# EAGLE schematic P2B14-001 (EAGLE 7.1.0)
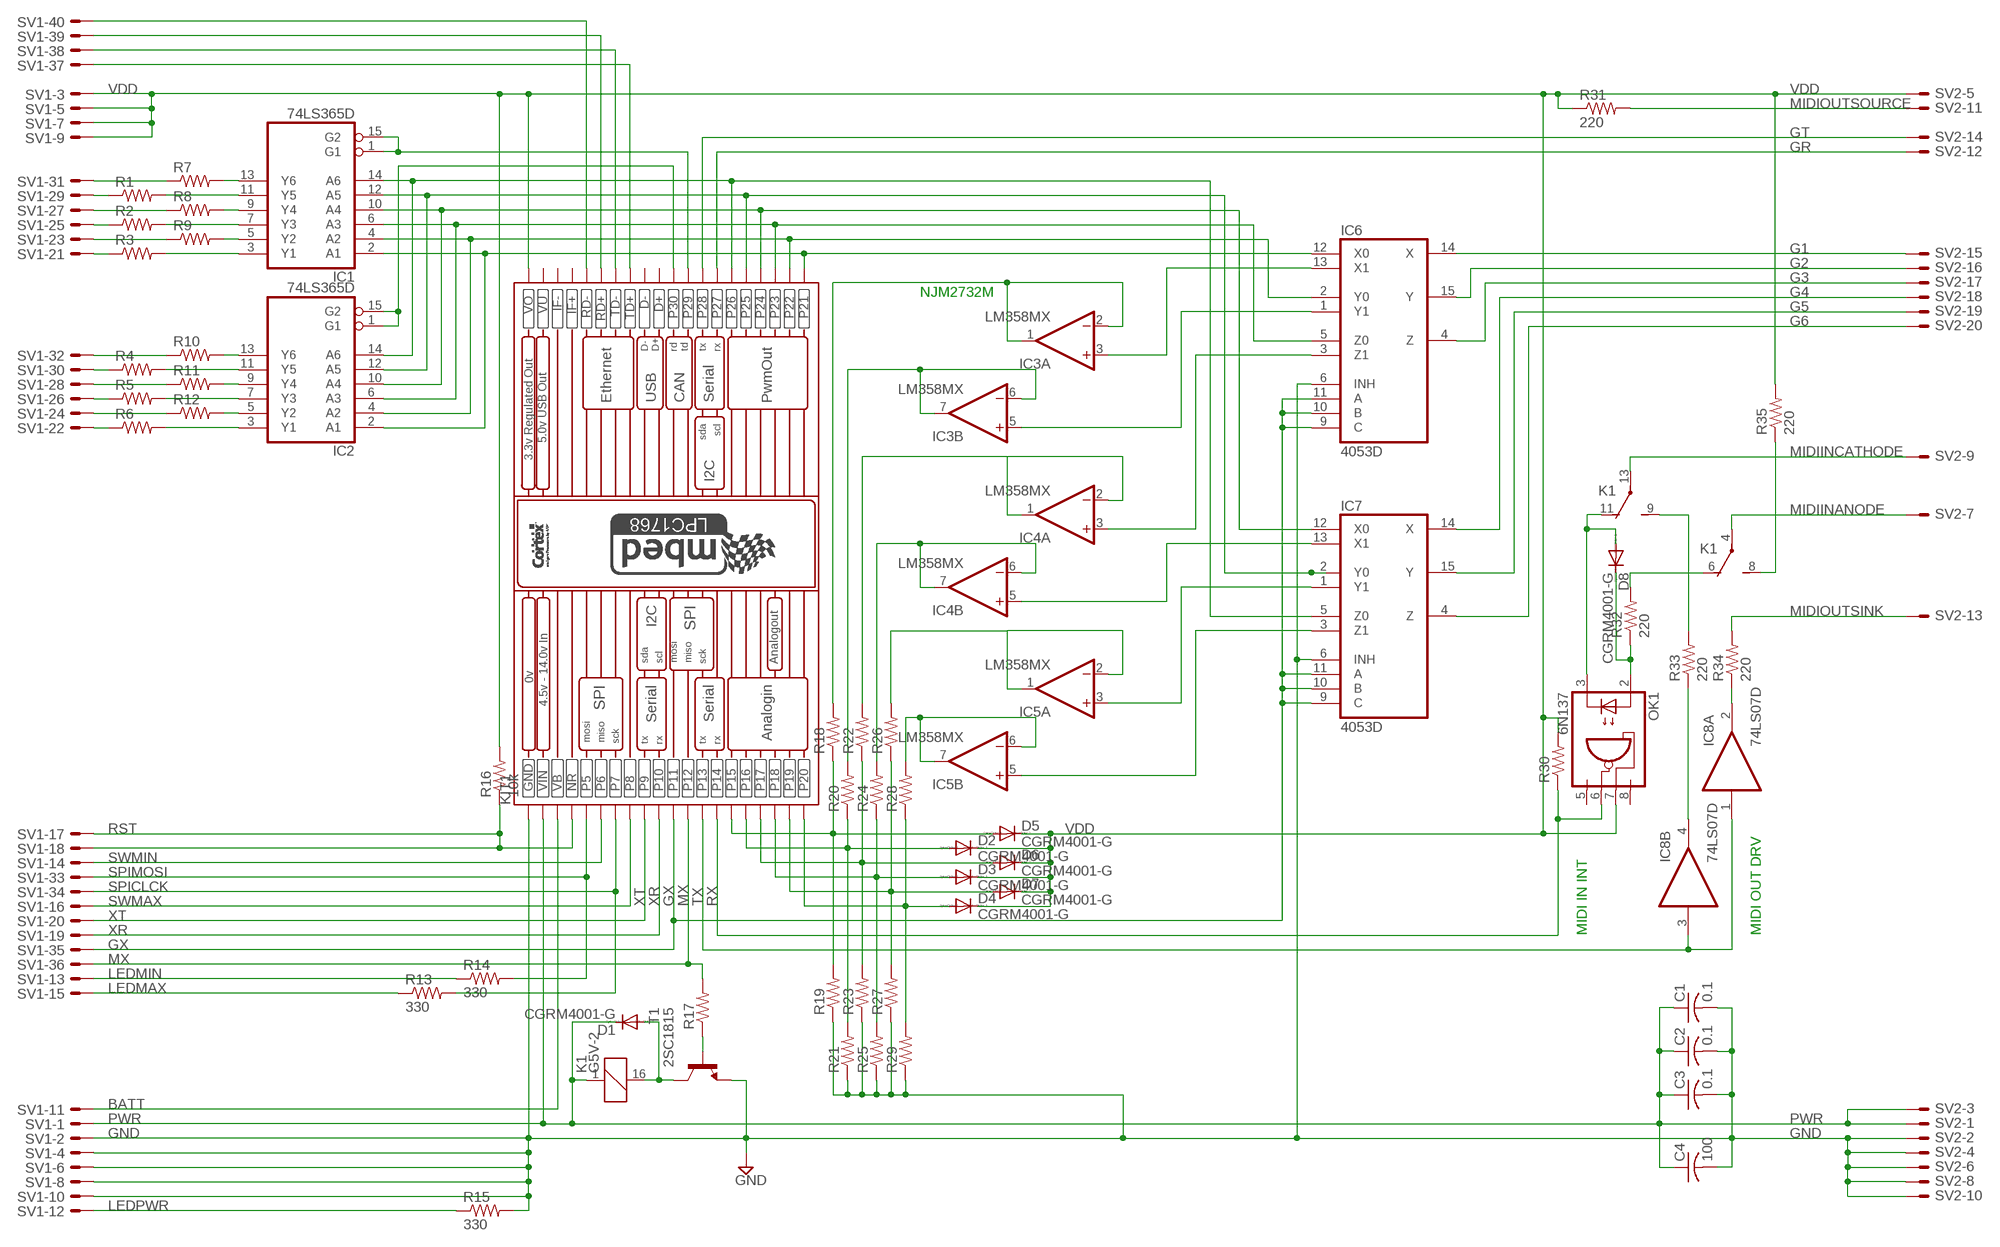
[diagram p0: schematic, sheet 1]

## Parts
C1  0.1  C-USC0402  [C0402]
C2  0.1  C-USC0402  [C0402]
C3  0.1  C-USC0402  [C0402]
C4  100  C-US025-050X050  [C025-050X050]
D1  CGRM4001-G  [SOD-123_MINI-SMA]
D2  CGRM4001-G  [SOD-123_MINI-SMA]
D3  CGRM4001-G  [SOD-123_MINI-SMA]
D4  CGRM4001-G  [SOD-123_MINI-SMA]
D5  CGRM4001-G  [SOD-123_MINI-SMA]
D6  CGRM4001-G  [SOD-123_MINI-SMA]
D7  CGRM4001-G  [SOD-123_MINI-SMA]
D8  CGRM4001-G  [SOD-123_MINI-SMA]
IC1  74LS365D  [SO16]
IC2  74LS365D  [SO16]
IC3  LM358MX  [SO08]
IC4  LM358MX  [SO08]
IC5  LM358MX  [SO08]
IC6  4053D  [SO16]
IC7  4053D  [SO16]
IC8  74LS07D  [SO14]
K1  G5V-2  [G5V-2]
KIT1  MBED_NXP_LPC1768  [MBED-KIT]
OK1  6N137  [DIL08]
R1  R-US_M0805  [M0805]
R2  R-US_M0805  [M0805]
R3  R-US_M0805  [M0805]
R4  R-US_M0805  [M0805]
R5  R-US_M0805  [M0805]
R6  R-US_M0805  [M0805]
R7  R-US_M0805  [M0805]
R8  R-US_M0805  [M0805]
R9  R-US_M0805  [M0805]
R10  R-US_M0805  [M0805]
R11  R-US_M0805  [M0805]
R12  R-US_M0805  [M0805]
R13  330  R-US_M0805  [M0805]
R14  330  R-US_M0805  [M0805]
R15  330  R-US_M0805  [M0805]
R16  10k  R-US_M0805  [M0805]
R17  R-US_M0805  [M0805]
R18  R-US_M0805  [M0805]
R19  R-US_M0805  [M0805]
R20  R-US_M0805  [M0805]
R21  R-US_M0805  [M0805]
R22  R-US_M0805  [M0805]
R23  R-US_M0805  [M0805]
R24  R-US_M0805  [M0805]
R25  R-US_M0805  [M0805]
R26  R-US_M0805  [M0805]
R27  R-US_M0805  [M0805]
R28  R-US_M0805  [M0805]
R29  R-US_M0805  [M0805]
R30  R-US_M0805  [M0805]
R31  220  R-US_M0805  [M0805]
R32  220  R-US_M0805  [M0805]
R33  220  R-US_M0805  [M0805]
R34  220  R-US_M0805  [M0805]
R35  220  R-US_M0805  [M0805]
SV1  ML40E  [ML40]
SV2  ML20LE  [ML20L]
T1  2SC1815  [TO92-ECB]

## Nets
BATT: KIT1.VB SV1.11
G1: IC6.14(X) SV2.15
G2: IC6.15(Y) SV2.16
G3: IC6.4(Z) SV2.17
G4: IC7.14(X) SV2.18
G5: IC7.15(Y) SV2.19
G6: IC7.4(Z) SV2.20
GND: C1.2 C2.2 C3.2 C4.2 IC6.6(INH) IC7.6(INH) KIT1.GND R15.2 R19.1 R21.1 R23.1 R25.1 R27.1 R29.1 SV1.2 SV1.4 SV1.6 SV1.8 SV1.10 SV2.2 SV2.4 SV2.6 SV2.8 SV2.10 T1.E
GR: KIT1.P$27(P27) SV2.12
GT: KIT1.P$28(P28) SV2.14
GX: IC6.9(C) IC6.10(B) IC6.11(A) IC7.9(C) IC7.10(B) IC7.11(A) KIT1.P$11(P11) SV1.35
LEDMAX: R13.1 SV1.15
LEDMIN: R14.1 SV1.13
LEDPWR: R15.1 SV1.12
MIDIINANODE: K1.4(1:P) SV2.7
MIDIINCATHODE: K1.13(2:P) SV2.9
MIDIOUTSINK: R34.2 SV2.13
MIDIOUTSOURCE: R31.2 SV2.11
MX: KIT1.P$12(P12) R17.2 SV1.36
N$1: IC1.2(A1) IC2.2(A1) IC6.12(X0) KIT1.P$21(P21)
N$2: K1.6(1:O) R32.2
N$3: IC3.6(B:-IN) IC3.7(B:OUT) R20.2
N$4: IC1.13(Y6) R7.2
N$5: K1.8(1:S) R35.1
N$6: D1.A K1.16 T1.C
N$7: IC8.4(B:O) R33.1
N$8: IC8.2(A:O) R34.1
N$9: IC1.6(A3) IC2.6(A3) IC6.5(Z0) KIT1.P$23(P23)
N$10: K1.9(2:S) R33.2
N$11: D3.A KIT1.P$18(P18) R24.1 R25.2
N$13: IC1.10(A4) IC2.10(A4) IC7.12(X0) KIT1.P$24(P24)
N$14: IC1.11(Y5) R1.2
N$15: IC1.4(A2) IC2.4(A2) IC6.2(Y0) KIT1.P$22(P22)
N$16: IC1.9(Y4) R8.2
N$17: IC1.7(Y3) R2.2
N$18: IC1.5(Y2) R9.2
N$19: IC4.1(A:OUT) IC4.2(A:-IN) R22.2
N$20: R17.1 T1.B
N$21: IC1.3(Y1) R3.2
N$22: IC2.13(Y6) R10.2
N$23: D8.C OK1.2(A) R32.1
N$24: IC2.1(G1) IC2.15(G2) KIT1.P$30(P30)
N$25: IC1.1(G1) IC1.15(G2) KIT1.P$29(P29)
N$26: IC2.11(Y5) R4.2
N$27: IC2.9(Y4) R11.2
N$28: D8.A K1.11(2:O) OK1.3(C)
N$29: IC2.7(Y3) R5.2
N$30: IC2.5(Y2) R12.2
N$31: IC2.3(Y1) R6.2
N$32: R3.1 SV1.21
N$33: R6.1 SV1.22
N$34: IC1.12(A5) IC2.12(A5) IC7.2(Y0) KIT1.P$25(P25)
N$35: IC1.14(A6) IC2.14(A6) IC7.5(Z0) KIT1.P$26(P26)
N$36: D5.A KIT1.P$15(P15) R18.1 R19.2
N$37: D2.A KIT1.P$16(P16) R20.1 R21.2
N$38: D6.A KIT1.P$17(P17) R22.1 R23.2
N$39: IC4.6(B:-IN) IC4.7(B:OUT) R24.2
N$40: D7.A KIT1.P$19(P19) R26.1 R27.2
N$41: D4.A KIT1.P$20(P20) R28.1 R29.2
N$42: R9.1 SV1.23
N$43: IC5.1(A:OUT) IC5.2(A:-IN) R26.2
N$44: IC5.6(B:-IN) IC5.7(B:OUT) R28.2
N$45: R12.1 SV1.24
N$46: R2.1 SV1.25
N$47: R5.1 SV1.26
N$48: R8.1 SV1.27
N$49: R11.1 SV1.28
N$50: R1.1 SV1.29
N$51: R4.1 SV1.30
N$52: R7.1 SV1.31
N$53: R10.1 SV1.32
N$55: KIT1.TD+ SV1.37
N$56: KIT1.TD- SV1.38
N$57: KIT1.RD+ SV1.39
N$58: KIT1.RD- SV1.40
N$59: IC3.1(A:OUT) IC3.2(A:-IN) R18.2
N$61: IC3.3(A:+IN) IC6.13(X1)
N$62: IC3.5(B:+IN) IC6.1(Y1)
N$63: IC4.3(A:+IN) IC6.3(Z1)
N$64: IC4.5(B:+IN) IC7.13(X1)
N$65: IC5.3(A:+IN) IC7.1(Y1)
N$66: IC5.5(B:+IN) IC7.3(Z1)
PWR: C1.1 C2.1 C3.1 C4.1 D1.C K1.1 KIT1.VIN SV1.1 SV2.1 SV2.3
RST: KIT1.NR R16.1 SV1.17 SV1.18
RX: KIT1.P$14(P14) OK1.6(VO) R30.1
SPICLCK: KIT1.P$7(P7) R13.2 SV1.34
SPIMOSI: KIT1.P$5(P5) R14.2 SV1.33
SWMAX: KIT1.P$8(P8) SV1.16
SWMIN: KIT1.P$6(P6) SV1.14
TX: IC8.1(A:I) IC8.3(B:I) KIT1.P$13(P13)
VDD: D2.C D3.C D4.C D5.C D6.C D7.C KIT1.VOUT(VO) OK1.7(VE) R16.2 R30.2 R31.1 R35.2 SV1.3 SV1.5 SV1.7 SV1.9 SV2.5
XR: KIT1.P$10(P10) SV1.19
XT: KIT1.P$9(P9) SV1.20
Unconnected: IC8.5(C:I) IC8.6(C:O) IC8.8(D:O) IC8.9(D:I) IC8.10(E:O) IC8.11(E:I) IC8.12(F:O) IC8.13(F:I) KIT1.D+ KIT1.D- KIT1.IF+ KIT1.IF- OK1.5(GND) OK1.8(VCC)

## Notes on the sheet
- NJM2732M
- MIDI IN INT | MIDI OUT DRV

## Power pins joined to a net without a drawn wire
GND: IC1.8(GND) IC2.8(GND) IC6.8(GND) IC7.8(GND) IC8.7(P:GND)
V+: IC3.8(P:V+) IC4.8(P:V+) IC5.8(P:V+)
V-: IC3.4(P:V-) IC4.4(P:V-) IC5.4(P:V-)
VCC: IC1.16(VCC) IC2.16(VCC) IC6.16(VCC) IC7.16(VCC) IC8.14(P:VCC)
VEE: IC6.7(VEE) IC7.7(VEE)
VU: KIT1.VU

## Library data of the parts
C1-C4 = resistor:C-US: CAPACITOR, American symbol
D1-D8 = diode:CGRM400*-G: Molded plasitc,JEDEC SOD-123/Mini SMA Source: Comchip CGRM4001-G.pdf
IC1 IC2 = 74xx-us:74*365: Hex BUS DRIVER, 3-state
IC3-IC5 = linear:LM358: OP AMP also LM158; LM258; LM2904 Source: http://cache.national.com/ds/LM/LM158.pdf
IC6 IC7 = 40xx:4053: Triple 2-channel ANALOG MULTIPLEXER
IC8 = 74xx-us:74*07: Hex BUFFER, open collector high-voltage output
K1 = relay:G5V-2: OMRON PCB Relay Source: http://www.omron.com/ecb/products/pdf/en-g5v2.pdf; MPN: G5V-2 5DC; OC_FARNELL: 9949488; OC_NEWARK: 78K5703
KIT1 = MBED_v2.1:MBED_NXP_LPC1768: Mbed LPC1768 - ARM CORTEX v2.1 * Schematic symbol is now placed in eagles's default raster. *The pads diameter are suitable for routing between mbed pins * mbed pads are 0.8 mm drill diameter. --------------------------------------------- Created by: Mohamed Yousry *Alexandria, Egypt *Email: mohamed.yousry@ieeegoldegypt.org
OK1 = optocoupler:6N137: MOTOROLA OPTO COUPLER; MPN: 6N137; OC_FARNELL: 1328376; OC_NEWARK: 52M1895
R1-R35 = resistor:R-US_: RESISTOR, American symbol
SV1 = con-ml:ML40E: HARTING; OC_FARNELL: unknown; OC_NEWARK: unknown
SV2 = con-ml:ML20LE: HARTING; OC_FARNELL: unknown; OC_NEWARK: unknown
T1 = transistor:2SC1815: NPN EPITAXIAL TRANSISTOR Source: TOSHIBA .. 2SC1815 1.pdf